# Altium schematic sheet DASH_CONNECTORS.SchDoc
size A
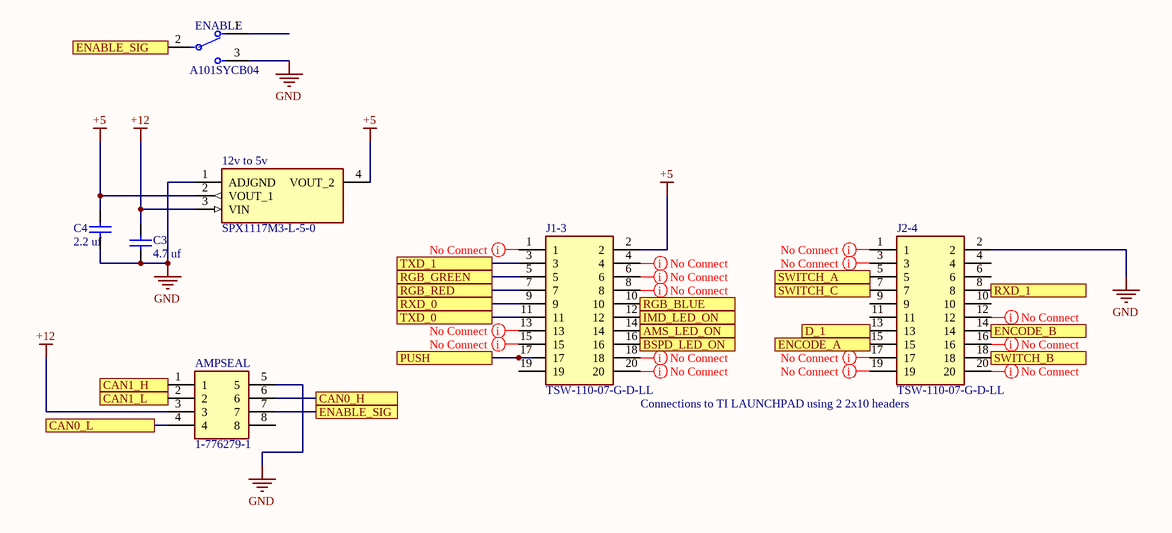
[diagram p0: DASH_CONNECTORS.SchDoc]

## Parts
12v_to_5v  SPX1117M3-L-5-0  [SOT230P700X170-4N]
AMPSEAL  1-776279-1  [17762791]
C3  4.7 uf  [CAPC1608X87X35NL15T15]
C4  2.2 uf  [CAPC1608X87X35NL15T15]
ENABLE  A101SYCB04  [FP-A101SYCB04-MFG]
J1-3  TSW-110-07-G-D-LL  [HDRV20W64P254_2X10_2540X495X838P]
J2-4  TSW-110-07-G-D-LL  [HDRV20W64P254_2X10_2540X495X838P]

## Ports
AMS_LED_ON, BSPD_LED_ON, CAN0_H, CAN0_L, CAN1_H, CAN1_L, D_1, ENABLE_SIG, ENCODE_A, ENCODE_B, IMD_LED_ON, PUSH, RGB_BLUE, RGB_GREEN, RGB_RED, RXD_0, RXD_1, SWITCH_A, SWITCH_B, SWITCH_C, TXD_0, TXD_1

## Nets
+5: 12v_to_5v.2(VOUT_1) 12v_to_5v.4(VOUT_2) C4.2 J1-3.2
+12: 12v_to_5v.3(VIN) AMPSEAL.3 C3.2
GND: 12v_to_5v.1(ADJGND) AMPSEAL.5 C3.1 C4.1 ENABLE.3 J2-4.2
AMS_LED_ON: J1-3.14 ; port AMS_LED_ON
BSPD_LED_ON: J1-3.16 ; port BSPD_LED_ON
CAN0_H: AMPSEAL.6 ; port CAN0_H
CAN0_L: AMPSEAL.4 ; port CAN0_L
CAN1_H: AMPSEAL.1 ; port CAN1_H
CAN1_L: AMPSEAL.2 ; port CAN1_L
D_1: J2-4.13 ; port D_1
ENABLE_SIG: AMPSEAL.7 ENABLE.2 ; port ENABLE_SIG
ENCODE_A: J2-4.15 ; port ENCODE_A
ENCODE_B: J2-4.14 ; port ENCODE_B
IMD_LED_ON: J1-3.12 ; port IMD_LED_ON
PUSH: J1-3.17 ; port PUSH
RGB_BLUE: J1-3.10 ; port RGB_BLUE
RGB_GREEN: J1-3.5 ; port RGB_GREEN
RGB_RED: J1-3.7 ; port RGB_RED
RXD_0: J1-3.9 ; port RXD_0
RXD_1: J2-4.8 ; port RXD_1
SWITCH_A: J2-4.5 ; port SWITCH_A
SWITCH_B: J2-4.18 ; port SWITCH_B
SWITCH_C: J2-4.7 ; port SWITCH_C
TXD_0: J1-3.11 ; port TXD_0
TXD_1: J1-3.3 ; port TXD_1

Not connected (* = marked no-connect by the designer): AMPSEAL 8; ENABLE 1; J1-3 1 4 6 8 13 15 18 19 20; J2-4 1 3 4 6 9 10 11 12 16 17 19 20

## Layout directives
mark named No Connect: NetJ1-3_1, NetJ1-3_4, NetJ1-3_6, NetJ1-3_8, NetJ1-3_13, NetJ1-3_15, NetJ1-3_18, NetJ1-3_20, NetJ2-4_1, NetJ2-4_3, NetJ2-4_12, NetJ2-4_16, NetJ2-4_17, NetJ2-4_19, NetJ2-4_20

## Notes on the sheet
- Connections to TI LAUNCHPAD using 2 2x10 headers

## Library data of the parts
12v_to_5v = SPX1117M3-L-5-0: Power Supply; Manufacturer_Name: EXAR; Datasheet Link: https://componentsearchengine.com/Datasheets/1/SPX1117M3-L-5-0.pdf; Height: 1.7mm; Manufacturer_Part_Number: SPX1117M3-L-5-0; Mouser Part Number: 701-SPX1117M3-L-5-0
AMPSEAL = 1-776279-1: Connector; Manufacturer_Name: TE Connectivity; Datasheet Link: https://www.te.com/commerce/DocumentDelivery/DDEController?Action=showdoc&DocId=Customer+Drawing%7F776279%7FF7%7Fpdf%7FEnglish%7FENG_CD_776279_F7.pdf%7F1-776279-1; Height: 32.1mm; Manufacturer_Part_Number: 1-776279-1; Mouser Part Number: 571-1-776279-1; Mouser Price/Stock: https://www.mouser.co.uk/ProductDetail/TE-Connectivity/1-776279-1?qs=tLAa1RwIH6fAW8GUe6Xfuw%3D%3D; Arrow Part Number: 1-776279-1; Arrow Price/Stock: https://www.arrow.com/en/products/1-776279-1/te-connectivity
C3 C4 = CMP-2006-03887-1: .1 uf; Part Number: C0603C104J3RAC7867; Manufacturer: Kemet
ENABLE = CMP-03408-000017-1: SWITCH TOGGLE SPDT 0.4VA 20V; Electrical Life: 6000Cycles; Number of Poles: 1; Power Rating: 400mW; Switch Function: On-On; Contact Resistance: 10mR; Contact Current Rating: 400mA; Actuator Material: Phenolic; Insulation Resistance: 30MR; Actuator Color: Chrome; Number of Positions: 2; Actuator Type: Standard Round; Actuator Length: 10.41mm; Illumination Type: Non-Illuminated; Flammability Rating: UL94 V-1; Contact Material: Copper; Depth: 6.86mm; Contact Plating: Gold; Voltage Rating (AC): 20V; Max Voltage Rating (DC): 20V; Min Operating Temperature: -30°C; Max Operating Temperature: 85°C; Throw Configuration: SPDT; Packaging: Bulk; Termination: PC Pins; Series: Gemini A; ELV: Compliant; Lead Free: Lead Free; RoHS Compliant: Yes; REACH SVHC: No SVHC; Mount: Panel; Orientation: Straight; Package Quantity: 100; Max Voltage Rating (AC): 20V; Radiation Hardening: No; Voltage Rating (DC): 20V
J1-3 J2-4 = TSW-110-07-G-D-LL: Connector; Manufacturer_Name: SAMTEC; Datasheet Link: http://suddendocs.samtec.com/catalog_english/tsw_th.pdf; Height: 8.38mm; Manufacturer_Part_Number: TSW-110-07-G-D-LL; Mouser Part Number: 200-TSW11007GDLL; Mouser Price/Stock: https://www.mouser.co.uk/ProductDetail/Samtec/TSW-110-07-G-D-LL?qs=rU5fayqh%252BE1TEdajvGip9g%3D%3D; Arrow Part Number: TSW-110-07-G-D-LL; Arrow Price/Stock: https://www.arrow.com/en/products/tsw-110-07-g-d-ll/samtec?region=nac